# EAGLE schematic STM32-H407_Rev_B (EAGLE 4.16)
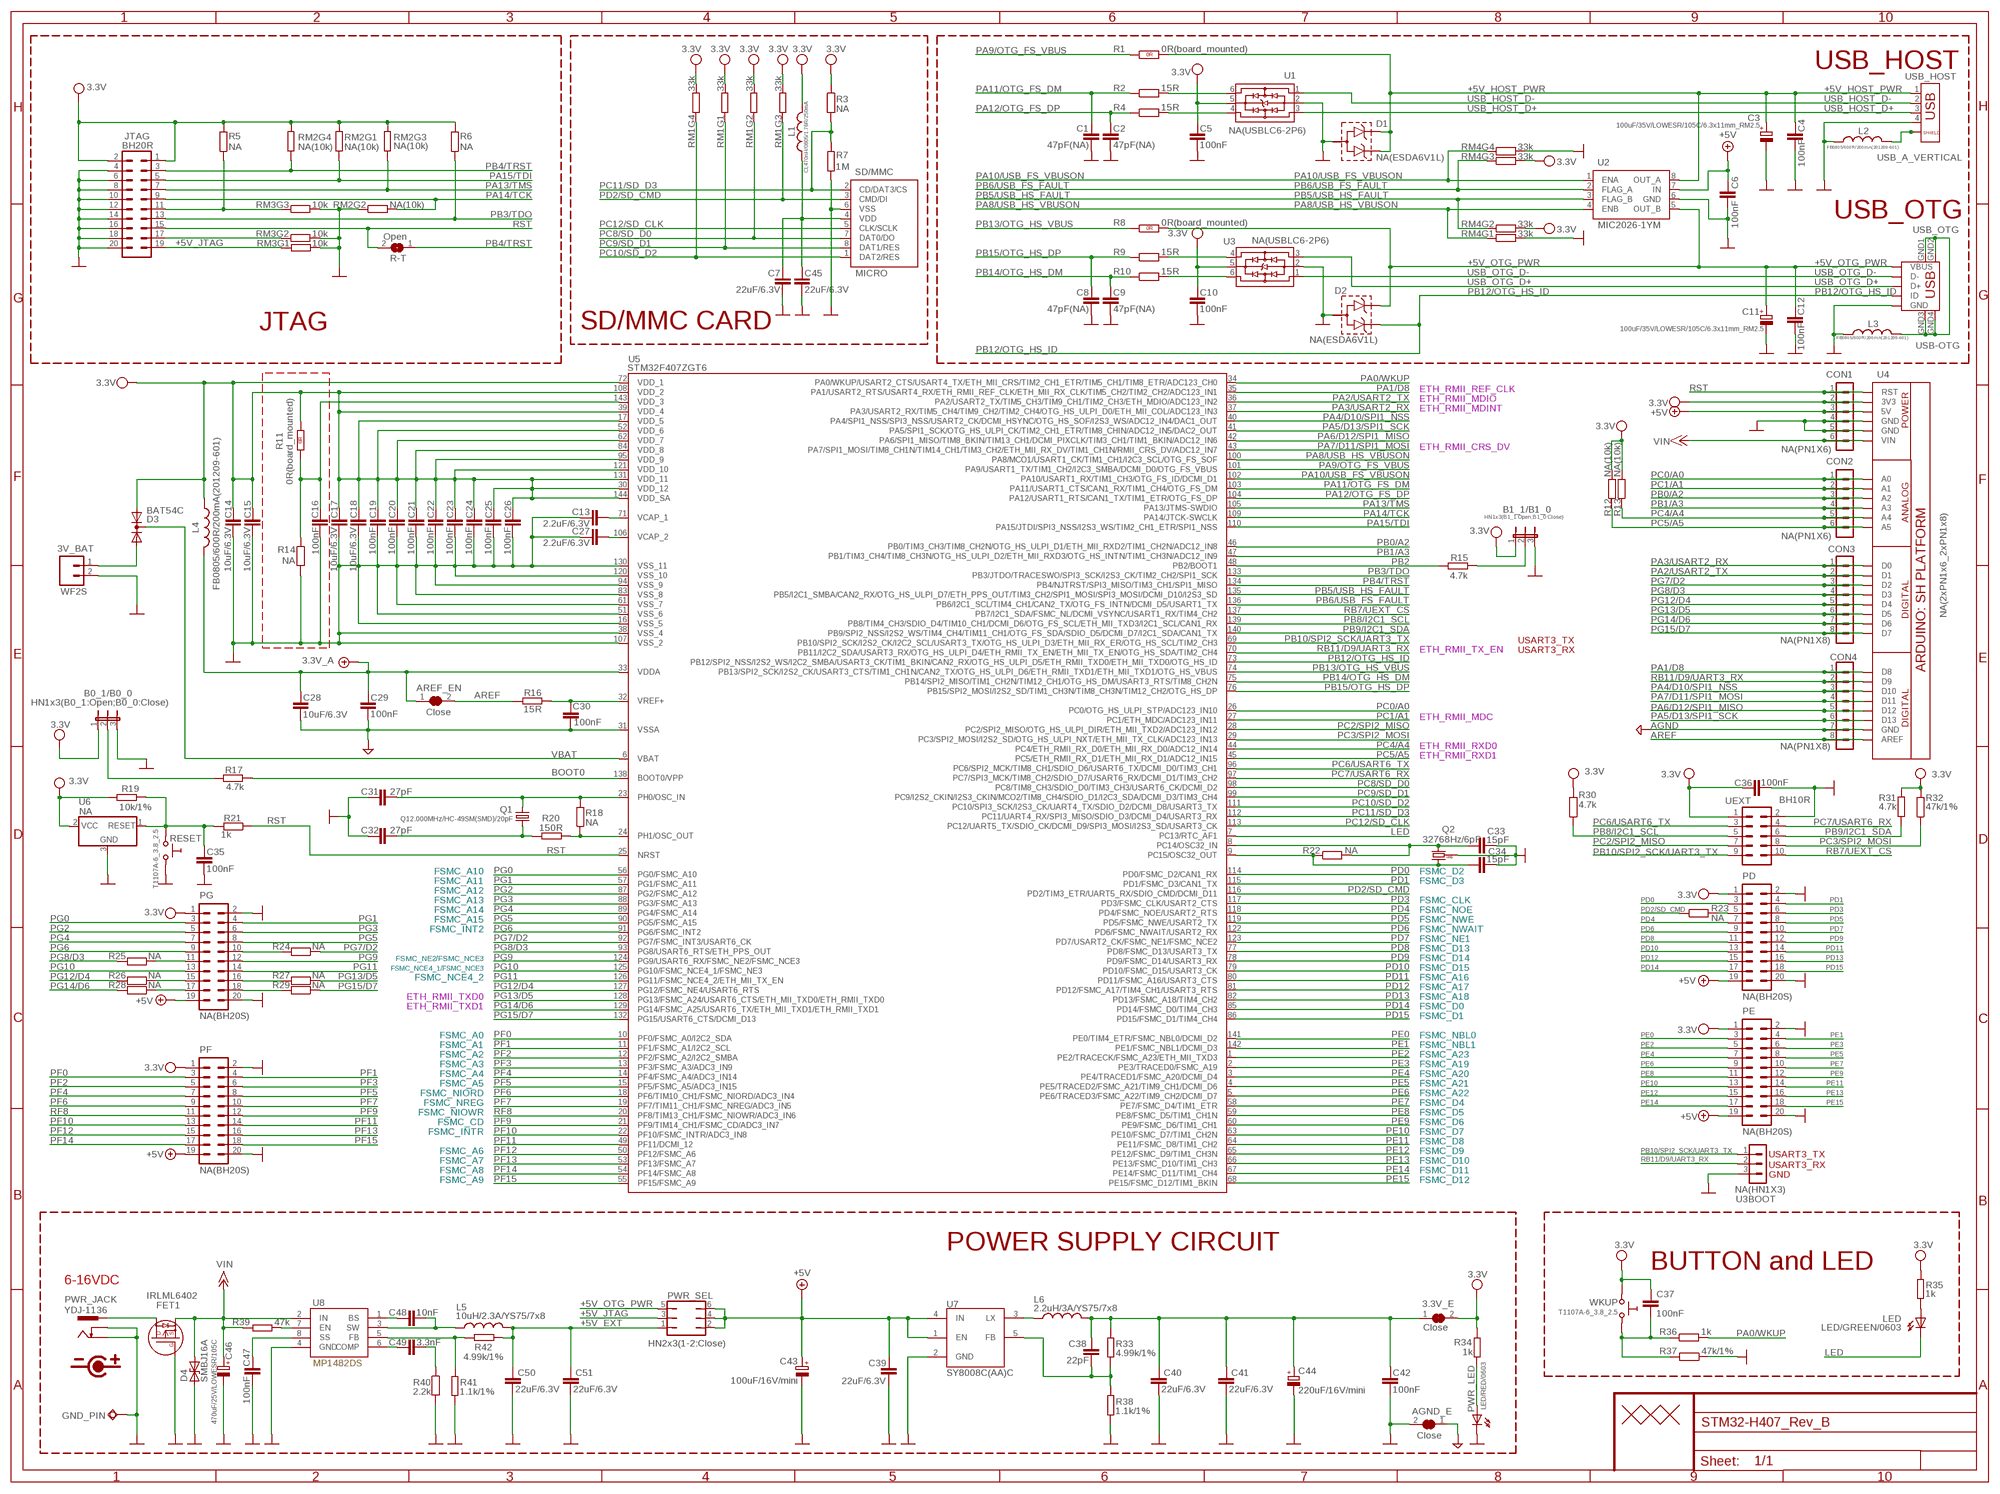
[diagram p0: schematic, sheet 1]

## Parts
3.3V_E  Close  SJSJ_1_SMALLER_CLOSE  [SJ_1_SMALLER_CLOSE]
3V_BAT  WF2S  CON2PV2-2.54MM  [CON2.54MM-2-0]
AGND_E  Close  SJSJ_1_SMALLER_CLOSE  [SJ_1_SMALLER_CLOSE]
AREF_EN  Close  SJSJ_1_SMALLER_CLOSE  [SJ_1_SMALLER_CLOSE]
B0_1/B0_0  HN1x3(B0_1:Open;B0_0:Close)  JP2E  [JP2]
B1_1/B1_0  HN1x3(B1_1:Open;B1_0:Close)  JP2E  [JP2]
C1  47pF(NA)  C-EUC0603_DWS  [C0603_DWS]
C2  47pF(NA)  C-EUC0603_DWS  [C0603_DWS]
C3  100uF/35V/LOWESR/105C/6.3x11mm_RM2.5  CPOL-EUE2.5-6.3  [E2,5-6,3]
C4  100nF  C-EUC0603_DWS  [C0603_DWS]
C5  100nF  C-EUC0603_DWS  [C0603_DWS]
C6  100nF  C-EUC0603_DWS  [C0603_DWS]
C7  22uF/6.3V  C-EUC0603_DWS  [C0603_DWS]
C8  47pF(NA)  C-EUC0603_DWS  [C0603_DWS]
C9  47pF(NA)  C-EUC0603_DWS  [C0603_DWS]
C10  100nF  C-EUC0603_DWS  [C0603_DWS]
C11  100uF/35V/LOWESR/105C/6.3x11mm_RM2.5  CPOL-EUE2.5-6.3  [E2,5-6,3]
C12  100nF  C-EUC0603_DWS  [C0603_DWS]
C13  2.2uF/6.3V  C-EUC0603_DWS  [C0603_DWS]
C14  10uF/6.3V  C-EUC0603_DWS  [C0603_DWS]
C15  10uF/6.3V  C-EUC0603_DWS  [C0603_DWS]
C16  100nF  C-EUC0603_DWS  [C0603_DWS]
C17  10uF/6.3V  C-EUC0603_DWS  [C0603_DWS]
C18  10uF/6.3V  C-EUC0603_DWS  [C0603_DWS]
C19  100nF  C-EUC0603_DWS  [C0603_DWS]
C20  100nF  C-EUC0603_DWS  [C0603_DWS]
C21  100nF  C-EUC0603_DWS  [C0603_DWS]
C22  100nF  C-EUC0603_DWS  [C0603_DWS]
C23  100nF  C-EUC0603_DWS  [C0603_DWS]
C24  100nF  C-EUC0603_DWS  [C0603_DWS]
C25  100nF  C-EUC0603_DWS  [C0603_DWS]
C26  100nF  C-EUC0603_DWS  [C0603_DWS]
C27  2.2uF/6.3V  C-EUC0603_DWS  [C0603_DWS]
C28  10uF/6.3V  C-EUC0603_DWS  [C0603_DWS]
C29  100nF  C-EUC0603_DWS  [C0603_DWS]
C30  100nF  C-EUC0603_DWS  [C0603_DWS]
C31  27pF  C-EUC0603_DWS  [C0603_DWS]
C32  27pF  C-EUC0603_DWS  [C0603_DWS]
C33  15pF  C-EUC0603_DWS  [C0603_DWS]
C34  15pF  C-EUC0603_DWS  [C0603_DWS]
C35  100nF  C-EUC0603_DWS  [C0603_DWS]
C36  100nF  C-EUC0603_DWS  [C0603_DWS]
C37  100nF  C-EUC0603_DWS  [C0603_DWS]
C38  22pF  C-EUC0603_DWS  [C0603_DWS]
C39  22uF/6.3V  C-EUC0603_DWS  [C0603_DWS]
C40  22uF/6.3V  C-EUC0603_DWS  [C0603_DWS]
C41  22uF/6.3V  C-EUC0603_DWS  [C0603_DWS]
C42  100nF  C-EUC0603_DWS  [C0603_DWS]
C43  100uF/16V/mini  CPOL-EUE2.5-6  [E2,5-6]
C44  220uF/16V/mini  CPOL-EUE3.5-8  [E3,5-8]
C45  22uF/6.3V  C-EUC0603_DWS  [C0603_DWS]
C46  470uF/25V/LOWESR/105C  CPOL-EUE5-10.5  [E5-10,5]
C47  100nF  C-EUC0603_DWS  [C0603_DWS]
C48  10nF  C-EUC0603_DWS  [C0603_DWS]
C49  3.3nF  C-EUC0603_DWS  [C0603_DWS]
C50  22uF/6.3V  C-EUC0603_DWS  [C0603_DWS]
C51  22uF/6.3V  C-EUC0603_DWS  [C0603_DWS]
CON1  NA(PN1X6)  CON6PN1X6  [PN1X6]
CON2  NA(PN1X6)  CON6PN1X6  [PN1X6]
CON3  NA(PN1X8)  CON8PN1X8  [PN1X8]
CON4  NA(PN1X8)  CON8PN1X8  [PN1X8]
D1  NA(ESDA6V1L)  MMBZ5V6ALT1  [SOT-23]
D2  NA(ESDA6V1L)  MMBZ5V6ALT1  [SOT-23]
D3  BAT54C  DIODE_AC-CA_  [SOT23C]
D4  SMBJ16A  SMBJ15A  [DO214AA]
FET1  IRLML6402  P-MOS+DIODIRLML6402  [SOT23]
GND_PIN  TESTPAD3  [TEST_PAD40/70/SQUARE]
JTAG  BH20R  ML20R  [BH20R]
L1  CL470nH/0805/1.76R/250mA  L-USL0805_5MIL_DWS  [L0805_5MIL_DWS]
L2  FB0805/600R/200mA(201209-601)  L-USL0805_5MIL_DWS  [L0805_5MIL_DWS]
L3  FB0805/600R/200mA(201209-601)  L-USL0805_5MIL_DWS  [L0805_5MIL_DWS]
L4  FB0805/600R/200mA(201209-601)  L-USL0805_5MIL_DWS  [L0805_5MIL_DWS]
L5  10uH/2.3A/YS75/7x8  L-USL7078  [L7078]
L6  2.2uH/3A/YS75/7x8  L-USL7078  [L7078]
LED  LED/GREEN/0603  LED0603DWS  [LED-0603]
PD  NA(BH20S)  ML20  [ML20-MALE]
PE  NA(BH20S)  ML20  [ML20-MALE]
PF  NA(BH20S)  ML20  [ML20-MALE]
PG  NA(BH20S)  ML20  [ML20-MALE]
PWR_JACK  YDJ-1136  PWR-JAKPWR_JACK_UNI_MILLING  [PWR_JACK_UNI_MILLING]
PWR_LED  LED/RED/0603  LED0603DWS  [LED-0603]
PWR_SEL  HN2x3(1-2:Close)  JP3QNEW  [JP3Q_NEW]
Q1  Q12.000MHz/HC-49SM(SMD)/20pF  HC49/S1  [HC49/SMD2_THIN]
Q2  32768Hz/6pF  Q_GND1  [TC26H_3_REPAIR_SMD]
R1  0R(board_mounted)  R_0R0R(NA)  [0603_0R]
R2  15R  R-EU_R0603_5MIL_DWS  [R0603_5MIL_DWS]
R3  NA  R-EU_R0603_5MIL_DWS_NA  [R0603_5MIL_DWS_NA]
R4  15R  R-EU_R0603_5MIL_DWS  [R0603_5MIL_DWS]
R5  NA  R-EU_R0603_5MIL_DWS_NA  [R0603_5MIL_DWS_NA]
R6  NA  R-EU_R0603_5MIL_DWS_NA  [R0603_5MIL_DWS_NA]
R7  1M  R-EU_R0603_5MIL_DWS  [R0603_5MIL_DWS]
R8  0R(board_mounted)  R_0R0R(NA)  [0603_0R]
R9  15R  R-EU_R0603_5MIL_DWS  [R0603_5MIL_DWS]
R10  15R  R-EU_R0603_5MIL_DWS  [R0603_5MIL_DWS]
R11  0R(board_mounted)  R_0R0R(NA)  [0603_0R]
R12  NA(10k)  R-EU_R0603_5MIL_DWS_NA  [R0603_5MIL_DWS_NA]
R13  NA(10k)  R-EU_R0603_5MIL_DWS_NA  [R0603_5MIL_DWS_NA]
R14  NA  R-EU_R0603_5MIL_DWS_NA  [R0603_5MIL_DWS_NA]
R15  4.7k  R-EU_R0603_5MIL_DWS  [R0603_5MIL_DWS]
R16  15R  R-EU_R0603_5MIL_DWS  [R0603_5MIL_DWS]
R17  4.7k  R-EU_R0603_5MIL_DWS  [R0603_5MIL_DWS]
R18  NA  R-EU_R0603_5MIL_DWS_NA  [R0603_5MIL_DWS_NA]
R19  10k/1%  R-EU_R0603_5MIL_DWS  [R0603_5MIL_DWS]
R20  150R  R-EU_R0603_5MIL_DWS  [R0603_5MIL_DWS]
R21  1k  R-EU_R0603_5MIL_DWS  [R0603_5MIL_DWS]
R22  NA  R-EU_R0603_5MIL_DWS_NA  [R0603_5MIL_DWS_NA]
R23  NA  R-EU_R0603_5MIL_DWS_NA  [R0603_5MIL_DWS_NA]
R24  NA  R-EU_R0603_5MIL_DWS  [R0603_5MIL_DWS]
R25  NA  R-EU_R0603_5MIL_DWS  [R0603_5MIL_DWS]
R26  NA  R-EU_R0603_5MIL_DWS  [R0603_5MIL_DWS]
R27  NA  R-EU_R0603_5MIL_DWS  [R0603_5MIL_DWS]
R28  NA  R-EU_R0603_5MIL_DWS  [R0603_5MIL_DWS]
R29  NA  R-EU_R0603_5MIL_DWS  [R0603_5MIL_DWS]
R30  4.7k  R-EU_R0603_5MIL_DWS  [R0603_5MIL_DWS]
R31  4.7k  R-EU_R0603_5MIL_DWS  [R0603_5MIL_DWS]
R32  47k/1%  R-EU_R0603_5MIL_DWS  [R0603_5MIL_DWS]
R33  4.99k/1%  R-EU_R0603_5MIL_DWS  [R0603_5MIL_DWS]
R34  1k  R-EU_R0603_5MIL_DWS  [R0603_5MIL_DWS]
R35  1k  R-EU_R0603_5MIL_DWS  [R0603_5MIL_DWS]
R36  1k  R-EU_R0603_5MIL_DWS  [R0603_5MIL_DWS]
R37  47k/1%  R-EU_R0603_5MIL_DWS  [R0603_5MIL_DWS]
R38  1.1k/1%  R-EU_R0603_5MIL_DWS  [R0603_5MIL_DWS]
R39  47k  R-EU_R0603_5MIL_DWS  [R0603_5MIL_DWS]
R40  2.2k  R-EU_R0603_5MIL_DWS  [R0603_5MIL_DWS]
R41  1.1k/1%  R-EU_R0603_5MIL_DWS  [R0603_5MIL_DWS]
R42  4.99k/1%  R-EU_R0603_5MIL_DWS  [R0603_5MIL_DWS]
R-T  Open  SJSJ_SMALLER  [SJ_1_SMALLER]
RESET  T1107A-6_3.8_2.5  SW-TAKT6  [SW-TAKT_6X3.5_SMD]
RM1  33k  R_MATRIX_4E  [R_MATRIX_4]
RM2  NA(10k)  R_MATRIX_4E  [R_MATRIX_4]
RM3  10k  R_MATRIX_4E  [R_MATRIX_4]
RM4  33k  R_MATRIX_4E  [R_MATRIX_4]
SD/MMC  MICRO  MICRO_SD/MMC  [TFR-MEM-CON]
U1  NA(USBLC6-2P6)  USBLC6-2  [USBLC6-2P6]
U2  MIC2026-1YM  [SO-8]
U3  NA(USBLC6-2P6)  USBLC6-2  [USBLC6-2P6]
U3BOOT  NA(HN1X3)  CON3HN1X3  [HN1X3]
U4  NA(2xPN1x6_2xPN1x8)  ARDUINO_SH_PLATFORM3  [ARDUINO_SHIELD_PLATFORM_WITHOUT_DIMENSION]
U5  STM32F407ZGT6  STM32F207ZET6  [LQFP144]
U6  NA  RESETMCP130T-300-I/TT  [SOT23]
U7  SY8008C(AA)C  SY8008  [SOT23-5]
U8  MP1482DS  MP1482  [SOIC8]
U$1  FIDUCIAL1X2  [FIDUCIAL-1X2]
U$2  FIDUCIAL1X2  [FIDUCIAL-1X2]
U$9  FIDUCIAL1X2  [FIDUCIAL-1X2]
UEXT  BH10R  ML10R  [BH10R]
USB_HOST  USB_A_VERTICAL  USB_SHIELDUSB_A_VERTICAL  [USB_A_VERTICAL_PTH]
USB_OTG  USB-OTG  MINI_USB9  [USB_MINI_9PIN]
WKUP  T1107A-6_3.8_2.5  SW-TAKT6  [SW-TAKT_6X3.5_SMD]

## Nets
+5V: C6.1 C39.1 C43.+ CON1.3 PD.19 PE.19 PF.19 PG.19 PWR_SEL.2 PWR_SEL.4 PWR_SEL.6 U2.7(IN) U4.5V U7.1(EN) U7.4(IN)
+5V_EXT: C50.1 C51.1 L5.2 PWR_SEL.1 R42.2
+5V_HOST_PWR: C3.+ C4.1 D1.1 D1.2 R1.2(1.2) U2.8(OUT_A) USB_HOST.1
+5V_JTAG: JTAG.19 PWR_SEL.3 RM3.1.1
+5V_OTG_PWR: C11.+ C12.1 D2.1 PWR_SEL.5 R8.2(1.2) U2.5(OUT_B) USB_OTG.VBUS
+7V: AREF_EN.1 C28.1 C29.2 L4.2 U5.33(VDDA) ; supply symbol labelled 3.3V_A
+15V: C46.+ CON1.6 D4.C FET1.2(S) R39.1 U4.VIN U8.2(IN) ; supply symbol labelled VIN
AGND: AGND_E.1 C28.2 C29.1 C30.1 CON4.7 U4.GND@2(GND) U5.31(VSSA)
AREF: AREF_EN.2 CON4.8 R16.1 U4.AREF
BOOT0: R17.1 U5.138(BOOT0/VPP)
GND [PWR]: 3V_BAT.2 AGND_E.2 B0_1/B0_0.3 B1_1/B1_0.3 C1.2 C2.2 C3.- C4.2 C5.1 C6.2 C7.2 C8.2 C9.2 C10.1 C11.- C12.2 C13.1 C14.1 C15.1 C16.1 C17.1 C18.1 C19.1 C20.1 C21.1 C22.1 C23.1 C24.1 C25.1 C26.1 C27.1 C31.2 C32.2 C33.2 C34.2 C35.1 C36.1 C39.2 C40.2 C41.2 C42.2 C43.- C44.- C45.2 C46.- C47.2 C50.2 C51.2 CON1.4 CON1.5 D1.3 D2.3 D4.A FET1.1(G) GND_PIN.P$1(PP) JTAG.4 JTAG.6 JTAG.8 JTAG.10 JTAG.12 JTAG.14 JTAG.16 JTAG.18 JTAG.20 L2.1 L3.1 PD.2 PD.20 PE.2 PE.20 PF.2 PF.20 PG.2 PG.20 PWR_JACK.- PWR_JACK.-- PWR_LED.C Q2.GND R7.2 R14.2 R37.1 R38.2 R40.2 R41.2 RESET.P$2 RM2.2.1 RM3.1.2 RM3.2.2 RM3.3.2 RM4.1.2 RM4.4.2 SD/MMC.6(VSS) U1.2 U2.6(GND) U3.2 U3BOOT.3 U4.GND U4.GND@1(GND) U5.16(VSS_5) U5.38(VSS_4) U5.51(VSS_6) U5.61(VSS_7) U5.83(VSS_8) U5.94(VSS_9) U5.107(VSS_2) U5.120(VSS_10) U5.130(VSS_11) U6.3(GND) U7.2(GND) U8.4(GND) UEXT.2 USB_HOST.4 USB_OTG.GND
LED: LED.C U5.7(PC13/RTC_AF1)
N$1: C31.1 Q1.2 R18.2 U5.23(PH0/OSC_IN)
N$2: C32.1 Q1.1 R20.1
N$3: R18.1 R20.2 U5.24(PH1/OSC_OUT)
N$4: JTAG.17 RM3.2.1
N$5: LED.A R35.1
N$6: PD.5 R23.2
N$8: C38.2 R33.2 R38.1 U7.5(FB)
N$9: B0_1/B0_0.2 R17.2
N$10 [PWR]: 3.3V_E.1 C38.1 C40.1 C41.1 C42.1 C44.+ L6.2 R33.1
N$12: PG.11 R25.1
N$13: PG.10 R24.2
N$14: PG.16 R27.2
N$15: R2.2 U1.6
N$16: R4.2 U1.4
N$17: PG.18 R29.2
N$18: PG.17 R28.1
N$19: PG.15 R26.1
N$25: C37.1 R36.1 R37.2 WKUP.P$2
N$29: B1_1/B1_0.2 R15.2
N$31: FET1.3(D) PWR_JACK.+
N$36: C47.1 U8.8(SS)
N$37: R39.2 U8.7(EN)
N$41: R9.2 U3.4
N$43: R10.2 U3.6
N$46: C48.1 U8.1(BS)
N$50: C48.2 L5.1 U8.3(SW)
N$60: C49.1 U8.6(COMP)
N$61: C49.2 R40.1
N$62: R41.1 R42.1 U8.5(FB)
N$64: L6.1 U7.3(LX)
N$75: 3V_BAT.1 D3.2(A2)
N$78: C7.1 C45.1 L1.2 SD/MMC.4(VDD)
N$85: JTAG.11 R5.1 RM3.3.1
N$117: C13.2 U5.71(VCAP_1)
N$128: C27.2 U5.106(VCAP_2)
N$129: PWR_LED.A R34.2
N$163: C35.2 R19.1 R21.2 RESET.P$1 U6.1(RESET)
N$266: L2.2 USB_HOST.P$3 USB_HOST.P$4
N$470: C16.2 R11.1(1.1) R14.1 U5.143(VDD_3)
PA0/WKUP: R36.2 U5.34(PA0/WKUP/USART2_CTS/USART4_TX/ETH_MII_CRS/TIM2_CH1_ETR/TIM5_CH1/TIM8_ETR/ADC123_CH0)
PA1/D8: CON4.1 U4.D8 U5.35(PA1/USART2_RTS/USART4_RX/ETH_RMII_REF_CLK/ETH_MII_RX_CLK/TIM5_CH2/TIM2_CH2/ADC123_IN1)
PA2/USART2_TX [thin]: CON3.2 U4.D1 U5.36(PA2/USART2_TX/TIM5_CH3/TIM9_CH1/TIM2_CH3/ETH_MDIO/ADC123_IN2)
PA3/USART2_RX: CON3.1 U4.D0 U5.37(PA3/USART2_RX/TIM5_CH4/TIM9_CH2/TIM2_CH4/OTG_HS_ULPI_D0/ETH_MII_COL/ADC123_IN3)
PA4/D10/SPI1_NSS: CON4.3 U4.D10 U5.40(PA4/SPI1_NSS/SPI3_NSS/USART2_CK/DCMI_HSYNC/OTG_HS_SOF/I2S3_WS/ADC12_IN4/DAC1_OUT)
PA5/D13/SPI1_SCK: CON4.6 U4.D13 U5.41(PA5/SPI1_SCK/OTG_HS_ULPI_CK/TIM2_CH1_ETR/TIM8_CHIN/ADC12_IN5/DAC2_OUT)
PA6/D12/SPI1_MISO: CON4.5 U4.D12 U5.42(PA6/SPI1_MISO/TIM8_BKIN/TIM13_CH1/DCMI_PIXCLK/TIM3_CH1/TIM1_BKIN/ADC12_IN6)
PA7/D11/SPI1_MOSI: CON4.4 U4.D11 U5.43(PA7/SPI1_MOSI/TIM8_CH1N/TIM14_CH1/TIM3_CH2/ETH_MII_RX_DV/TIM1_CH1N/RMII_CRS_DV/ADC12_IN7)
PA8/USB_HS_VBUSON: RM4.1.1 U2.4(ENB) U5.100(PA8/MCO1/USART1_CK/TIM1_CH1/I2C3_SCL/OTG_FS_SOF)
PA9/OTG_FS_VBUS: R1.1(1.1) U5.101(PA9/USART1_TX/TIM1_CH2/I2C3_SMBA/DCMI_D0/OTG_FS_VBUS)
PA10/USB_FS_VBUSON: RM4.4.1 U2.1(ENA) U5.102(PA10/USART1_RX/TIM1_CH3/OTG_FS_ID/DCMI_D1)
PA11/OTG_FS_DM: C1.1 R2.1 U5.103(PA11/USART1_CTS/CAN1_RX/TIM1_CH4/OTG_FS_DM)
PA12/OTG_FS_DP: C2.1 R4.1 U5.104(PA12/USART1_RTS/CAN1_TX/TIM1_ETR/OTG_FS_DP)
PA13/TMS: JTAG.7 RM2.3.1 U5.105(PA13/JTMS-SWDIO)
PA14/TCK: JTAG.9 RM2.2.2 U5.109(PA14/JTCK-SWCLK)
PA15/TDI: JTAG.5 RM2.1.1 U5.110(PA15/JTDI/SPI3_NSS/I2S3_WS/TIM2_CH1_ETR/SPI1_NSS)
PB0/A2: CON2.3 U4.A2 U5.46(PB0/TIM3_CH3/TIM8_CH2N/OTG_HS_ULPI_D1/ETH_MII_RXD2/TIM1_CH2N/ADC12_IN8)
PB1/A3: CON2.4 U4.A3 U5.47(PB1/TIM3_CH4/TIM8_CH3N/OTG_HS_ULPI_D2/ETH_MII_RXD3/OTG_HS_INTN/TIM1_CH3N/ADC12_IN9)
PB2: R15.1 U5.48(PB2/BOOT1)
PB3/TDO: JTAG.13 R6.1 U5.133(PB3/JTDO/TRACESWO/SPI3_SCK/I2S3_CK/TIM2_CH2/SPI1_SCK)
PB4/TRST: JTAG.3 R-T.1 RM2.4.1 U5.134(PB4/NJTRST/SPI3_MISO/TIM3_CH1/SPI1_MISO)
PB5/USB_HS_FAULT: RM4.2.1 U2.3(FLAG_B) U5.135(PB5/I2C1_SMBA/CAN2_RX/OTG_HS_ULPI_D7/ETH_PPS_OUT/TIM3_CH2/SPI1_MOSI/SPI3_MOSI/DCMI_D10/I2S3_SD)
PB6/USB_FS_FAULT: RM4.3.1 U2.2(FLAG_A) U5.136(PB6/I2C1_SCL/TIM4_CH1/CAN2_TX/OTG_FS_INTN/DCMI_D5/USART1_TX)
PB8/I2C1_SCL: R30.1 U5.139(PB8/TIM4_CH3/SDIO_D4/TIM10_CH1/DCMI_D6/OTG_FS_SCL/ETH_MII_TXD3/I2C1_SCL/CAN1_RX) UEXT.5
PB9/I2C1_SDA: R31.1 U5.140(PB9/SPI2_NSS/I2S2_WS/TIM4_CH4/TIM11_CH1/OTG_FS_SDA/SDIO_D5/DCMI_D7/I2C1_SDA/CAN1_TX) UEXT.6
PB10/SPI2_SCK/UART3_TX: U3BOOT.1 U5.69(PB10/SPI2_SCK/I2S2_CK/I2C2_SCL/USART3_TX/OTG_HS_ULPI_D3/ETH_MII_RX_ER/OTG_HS_SCL/TIM2_CH3) UEXT.9
PB12/OTG_HS_ID: D2.2 U5.73(PB12/SPI2_NSS/I2S2_WS/I2C2_SMBA/USART3_CK/TIM1_BKIN/CAN2_RX/OTG_HS_ULPI_D5/ETH_RMII_TXD0/ETH_MII_TXD0/OTG_HS_ID) USB_OTG.ID
PB13/OTG_HS_VBUS: R8.1(1.1) U5.74(PB13/SPI2_SCK/I2S2_CK/USART3_CTS/TIM1_CH1N/CAN2_TX/OTG_HS_ULPI_D6/ETH_RMII_TXD1/ETH_MII_TXD1/OTG_HS_VBUS)
PB14/OTG_HS_DM: C9.1 R10.1 U5.75(PB14/SPI2_MISO/TIM1_CH2N/TIM12_CH1/OTG_HS_DM/USART3_RTS/TIM8_CH2N)
PB15/OTG_HS_DP: C8.1 R9.1 U5.76(PB15/SPI2_MOSI/I2S2_SD/TIM1_CH3N/TIM8_CH3N/TIM12_CH2/OTG_HS_DP)
PC0/A0: CON2.1 U4.A0 U5.26(PC0/OTG_HS_ULPI_STP/ADC123_IN10)
PC1/A1: CON2.2 U4.A1 U5.27(PC1/ETH_MDC/ADC123_IN11)
PC2/SPI2_MISO: U5.28(PC2/SPI2_MISO/OTG_HS_ULPI_DIR/ETH_MII_TXD2/ADC123_IN12) UEXT.7
PC3/SPI2_MOSI: R32.1 U5.29(PC3/SPI2_MOSI/I2S2_SD/OTG_HS_ULPI_NXT/ETH_MII_TX_CLK/ADC123_IN13) UEXT.8
PC4/A4: CON2.5 R13.1 U4.A4 U5.44(PC4/ETH_RMII_RX_D0/ETH_MII_RX_D0/ADC12_IN14)
PC5/A5: CON2.6 R12.1 U4.A5 U5.45(PC5/ETH_RMII_RX_D1/ETH_MII_RX_D1/ADC12_IN15)
PC6/USART6_TX: U5.96(PC6/SPI2_MCK/TIM8_CH1/SDIO_D6/USART6_TX/DCMI_D0/TIM3_CH1) UEXT.3
PC7/USART6_RX: U5.97(PC7/SPI3_MCK/TIM8_CH2/SDIO_D7/USART6_RX/DCMI_D1/TIM3_CH2) UEXT.4
PC8/SD_D0: RM1.2.1 SD/MMC.7(DAT0/DO) U5.98(PC8/TIM8_CH3/SDIO_D0/TIM3_CH3/USART6_CK/DCMI_D2)
PC9/SD_D1: RM1.1.1 SD/MMC.8(DAT1/RES) U5.99(PC9/I2S2_CKIN/I2S3_CKIN/MCO2/TIM8_CH4/SDIO_D1/I2C3_SDA/DCMI_D3/TIM3_CH4)
PC10/SD_D2: RM1.4.1 SD/MMC.1(DAT2/RES) U5.111(PC10/SPI3_SCK/I2S3_CK/UART4_TX/SDIO_D2/DCMI_D8/USART3_TX)
PC11/SD_D3: R3.2 R7.1 SD/MMC.2(CD/DAT3/CS) U5.112(PC11/UART4_RX/SPI3_MISO/SDIO_D3/DCMI_D4/USART3_RX)
PC12/SD_CLK: SD/MMC.5(CLK/SCLK) U5.113(PC12/UART5_TX/SDIO_CK/DCMI_D9/SPI3_MOSI/I2S3_SD/USART3_CK)
PC14: C33.1 Q2.2 R22.2 U5.8(PC14/OSC32_IN)
PC15: C34.1 Q2.1 R22.1 U5.9(PC15/OSC32_OUT)
PD0: PD.3 U5.114(PD0/FSMC_D2/CAN1_RX)
PD1 [thin]: PD.4 U5.115(PD1/FSMC_D3/CAN1_TX)
PD2/SD_CMD: R23.1 RM1.3.1 SD/MMC.3(CMD/DI) U5.116(PD2/TIM3_ETR/UART5_RX/SDIO_CMD/DCMI_D11)
PD3: PD.6 U5.117(PD3/FSMC_CLK/USART2_CTS)
PD4: PD.7 U5.118(PD4/FSMC_NOE/USART2_RTS)
PD5: PD.8 U5.119(PD5/FSMC_NWE/USART2_TX)
PD6: PD.9 U5.122(PD6/FSMC_NWAIT/USART2_RX)
PD7: PD.10 U5.123(PD7/USART2_CK/FSMC_NE1/FSMC_NCE2)
PD8 [thin]: PD.11 U5.77(PD8/FSMC_D13/USART3_TX)
PD9: PD.12 U5.78(PD9/FSMC_D14/USART3_RX)
PD10: PD.13 U5.79(PD10/FSMC_D15/USART3_CK)
PD11 [thin]: PD.14 U5.80(PD11/FSMC_A16/USART3_CTS)
PD12 [thin]: PD.15 U5.81(PD12/FSMC_A17/TIM4_CH1/USART3_RTS)
PD13: PD.16 U5.82(PD13/FSMC_A18/TIM4_CH2)
PD14: PD.17 U5.85(PD14/FSMC_D0/TIM4_CH3)
PD15 [thin]: PD.18 U5.86(PD15/FSMC_D1/TIM4_CH4)
PE0: PE.3 U5.141(PE0/TIM4_ETR/FSMC_NBL0/DCMI_D2)
PE1 [thin]: PE.4 U5.142(PE1/FSMC_NBL1/DCMI_D3)
PE2: PE.5 U5.1(PE2/TRACECK/FSMC_A23/ETH_MII_TXD3)
PE3: PE.6 U5.2(PE3/TRACED0/FSMC_A19)
PE4: PE.7 U5.3(PE4/TRACED1/FSMC_A20/DCMI_D4)
PE5: PE.8 U5.4(PE5/TRACED2/FSMC_A21/TIM9_CH1/DCMI_D6)
PE6: PE.9 U5.5(PE6/TRACED3/FSMC_A22/TIM9_CH2/DCMI_D7)
PE7 [thin]: PE.10 U5.58(PE7/FSMC_D4/TIM1_ETR)
PE8 [thin]: PE.11 U5.59(PE8/FSMC_D5/TIM1_CH1N)
PE9: PE.12 U5.60(PE9/FSMC_D6/TIM1_CH1)
PE10: PE.13 U5.63(PE10/FSMC_D7/TIM1_CH2N)
PE11: PE.14 U5.64(PE11/FSMC_D8/TIM1_CH2)
PE12: PE.15 U5.65(PE12/FSMC_D9/TIM1_CH3N)
PE13 [thin]: PE.16 U5.66(PE13/FSMC_D10/TIM1_CH3)
PE14 [thin]: PE.17 U5.67(PE14/FSMC_D11/TIM1_CH4)
PE15 [thin]: PE.18 U5.68(PE15/FSMC_D12/TIM1_BKIN)
PF0: PF.3 U5.10(PF0/FSMC_A0/I2C2_SDA)
PF1: PF.4 U5.11(PF1/FSMC_A1/I2C2_SCL)
PF2: PF.5 U5.12(PF2/FSMC_A2/I2C2_SMBA)
PF3: PF.6 U5.13(PF3/FSMC_A3/ADC3_IN9)
PF4: PF.7 U5.14(PF4/FSMC_A4/ADC3_IN14)
PF5 [thin]: PF.8 U5.15(PF5/FSMC_A5/ADC3_IN15)
PF6: PF.9 U5.18(PF6/TIM10_CH1/FSMC_NIORD/ADC3_IN4)
PF7: PF.10 U5.19(PF7/TIM11_CH1/FSMC_NREG/ADC3_IN5)
PF9: PF.12 U5.21(PF9/TIM14_CH1/FSMC_CD/ADC3_IN7)
PF10: PF.13 U5.22(PF10/FSMC_INTR/ADC3_IN8)
PF11: PF.14 U5.49(PF11/DCMI_12)
PF12 [thin]: PF.15 U5.50(PF12/FSMC_A6)
PF13 [thin]: PF.16 U5.53(PF13/FSMC_A7)
PF14 [thin]: PF.17 U5.54(PF14/FSMC_A8)
PF15: PF.18 U5.55(PF15/FSMC_A9)
PG0 [thin]: PG.3 U5.56(PG0/FSMC_A10)
PG1 [thin]: PG.4 U5.57(PG1/FSMC_A11)
PG2: PG.5 U5.87(PG2/FSMC_A12)
PG3: PG.6 U5.88(PG3/FSMC_A13)
PG4 [thin]: PG.7 U5.89(PG4/FSMC_A14)
PG5 [thin]: PG.8 U5.90(PG5/FSMC_A15)
PG6: PG.9 U5.91(PG6/FSMC_INT2)
PG7/D2: CON3.3 R24.1 U4.D2 U5.92(PG7/FSMC_INT3/USART6_CK)
PG8/D3: CON3.4 R25.2 U4.D3 U5.93(PG8/USART6_RTS/ETH_PPS_OUT)
PG9: PG.12 U5.124(PG9/USART6_RX/FSMC_NE2/FSMC_NCE3)
PG10: PG.13 U5.125(PG10/FSMC_NCE4_1/FSMC_NE3)
PG11: PG.14 U5.126(PG11/FSMC_NCE4_2/ETH_MII_TX_EN)
PG12/D4: CON3.5 R26.2 U4.D4 U5.127(PG12/FSMC_NE4/USART6_RTS)
PG13/D5: CON3.6 R27.1 U4.D5 U5.128(PG13/FSMC_A24/USART6_CTS/ETH_MII_TXD0/ETH_RMII_TXD0)
PG14/D6: CON3.7 R28.2 U4.D6 U5.129(PG14/FSMC_A25/USART6_TX/ETH_MII_TXD1/ETH_RMII_TXD1)
PG15/D7: CON3.8 R29.1 U4.D7 U5.132(PG15/USART6_CTS/DCMI_D13)
RB7/UEXT_CS: U5.137(PB7/I2C1_SDA/FSMC_NL/DCMI_VSYNC/USART1_RX/TIM4_CH2) UEXT.10
RB11/D9/UART3_RX: CON4.2 U3BOOT.2 U4.D9 U5.70(PB11/I2C2_SDA/USART3_RX/OTG_HS_ULPI_D4/ETH_RMII_TX_EN/ETH_MII_TX_EN/OTG_HS_SDA/TIM2_CH4)
RF8: PF.11 U5.20(PF8/TIM13_CH1/FSMC_NIOWR/ADC3_IN6)
RST: CON1.1 JTAG.15 R21.1 R-T.2 U4.RST U5.25(NRST)
USB_HOST_D+: U1.3 USB_HOST.3
USB_HOST_D-: U1.1 USB_HOST.2
USB_OTG_D+: U3.3 USB_OTG.D+
USB_OTG_D-: U3.1 USB_OTG.D-
USB_SHIELD: L3.2 USB_OTG.GND1 USB_OTG.GND2 USB_OTG.GND3 USB_OTG.GND4
VBAT: D3.3(K) U5.6(VBAT)
VCC [PWR]: 3.3V_E.2 B0_1/B0_0.1 B1_1/B1_0.1 C5.2 C10.2 C14.2 C15.2 C17.2 C18.2 C19.2 C20.2 C21.2 C22.2 C23.2 C24.2 C25.2 C26.2 C36.2 C37.2 CON1.2 D3.1(A1) JTAG.1 JTAG.2 L1.1 L4.1 PD.1 PE.1 PF.1 PG.1 R3.1 R5.2 R6.2 R11.2(1.2) R12.2 R13.2 R19.2 R30.2 R31.2 R32.2 R34.1 R35.2 RM1.1.2 RM1.2.2 RM1.3.2 RM1.4.2 RM2.1.2 RM2.3.2 RM2.4.2 RM4.2.2 RM4.3.2 U1.5 U3.5 U4.3V3 U5.17(VDD_5) U5.30(VDD_12) U5.39(VDD_4) U5.52(VDD_6) U5.62(VDD_7) U5.72(VDD_1) U5.84(VDD_8) U5.95(VDD_9) U5.108(VDD_2) U5.121(VDD_10) U5.131(VDD_11) U5.144(VDD_SA) U6.2(VCC) UEXT.1 WKUP.P$1 ; supply symbol labelled 3.3V
VREF+: C30.2 R16.2 U5.32(VREF+)
Unconnected: RM3.4.1 RM3.4.2

## Notes on the sheet
- USB_HOST
- USB_OTG
- JTAG | SD/MMC CARD
- ETH_RMII_REF_CLK
- ETH_RMII_MDIO
- ETH_RMII_MDINT
- ETH_RMII_CRS_DV
- USART3_TX
- ETH_RMII_TX_EN | USART3_RX
- ETH_RMII_MDC
- ETH_RMII_RXD0
- ETH_RMII_RXD1
- FSMC_A10 | FSMC_D2
- FSMC_A11 | FSMC_D3
- FSMC_A12
- FSMC_A13 | FSMC_CLK
- FSMC_A14 | FSMC_NOE
- FSMC_A15 | FSMC_NWE
- FSMC_INT2 | FSMC_NWAIT
- FSMC_NE1
- FSMC_D13
- FSMC_NE2/FSMC_NCE3 | FSMC_D14
- FSMC_NCE4_1/FSMC_NCE3 | FSMC_D15
- FSMC_NCE4_2 | FSMC_A16
- FSMC_A17
- ETH_RMII_TXD0 | FSMC_A18
- ETH_RMII_TXD1 | FSMC_D0
- FSMC_D1
- FSMC_A0 | FSMC_NBL0
- FSMC_A1 | FSMC_NBL1
- FSMC_A2 | FSMC_A23
- FSMC_A3 | FSMC_A19
- FSMC_A4 | FSMC_A20
- FSMC_A5 | FSMC_A21
- FSMC_NIORD | FSMC_A22
- FSMC_NREG | FSMC_D4
- FSMC_NIOWR | FSMC_D5
- FSMC_CD | FSMC_D6
- FSMC_INTR | FSMC_D7
- FSMC_D8
- USART3_TX
- FSMC_A6 | FSMC_D9
- FSMC_A7 | FSMC_D10 | USART3_RX
- FSMC_A8 | FSMC_D11 | GND
- FSMC_A9 | FSMC_D12
- POWER SUPPLY CIRCUIT
- BUTTON and LED
- 6-16VDC

## Library data of the parts
3.3V_E AGND_E AREF_EN R-T = jumper:SJ: SMD solder JUMPER
3V_BAT = DOUBLE-SIDE:CON2: CONNECTORS - 2 PINS
B0_1/B0_0 B1_1/B1_0 = jumper:JP2E: JUMPER
C1 C2 C4-C10 C12-C42 C45 C47-C51 = rcl:C-EU: CAPACITOR, European symbol
C3 C11 C43 C44 C46 = rcl:CPOL-EU: POLARIZED CAPACITOR, European symbol
CON1 CON2 = Penko:CON6: CONNECTORS - 6 PINS
CON3 CON4 = Penko:CON8
D1 D2 = OLIMEX_DISCRET:MMBZ5V6ALT1
D3 = semicon-smd-ipc:DIODE_AC-CA_: DUAL DIODE
D4 = OLIMEX_DISCRET:SMBJ15A
FET1 = Penko:P-MOS+DIOD
GND_PIN = gogo:TESTPAD: drill 40mils, diameter 70mils
JTAG PD PE PF PG = con-harting-ml:ML20: HARTING
L1-L6 = rcl:L-US: INDUCTOR, American symbol
LED PWR_LED = DOUBLE-SIDE:LED
PWR_JACK = gogo:PWR-JAK
PWR_SEL = jumper:JP3Q: JUMPER
Q1 = crystal:HC49/S: CRYSTAL
Q2 = crystal:Q_GND
R1 R8 R11 = OLIMEX_DISCRET:R_0R
R2-R7 R9 R10 R12-R42 = rcl:R-EU_: RESISTOR, European symbol
RESET WKUP = gogo:SW-TAKT
RM1-RM4 = OLIMEX_DISCRET:R_MATRIX_4E
SD/MMC = OLIMEX_CONNECTORS:MICRO_SD/MMC
U1 U3 = OLIMEX_IC:USBLC6-2
U2 = OLIMEX_IC:MIC2026: LM3526 Dual Port USB Power Switch and Over-Current Protection Features: -> Compatible with USB1.1 and USB2.0; -> 1 ms fault flag delay filters Hot-Plug events; -> Smooth turn-on eliminates in-rush induced voltage drop; -> UL recognized component: REF#205202; -> 1A nominal shortcircuit output current protects PC power supplies; -> Thermal shutdown protects device in direct short condition; -> 500mA minimum continuous load current; -> Small SO-8 package minimizes board space; -> 2.7V to 5.5V input voltage range; -> 140mOhm Max.switch resistance; -> 1 µA Max. standby current; -> 200µA Max. operating current; -> Under-voltage lockout(UVLO);
U3BOOT = Penko:CON3
U4 = OLIMEX_CASES:ARDUINO_SH_PLATFORM
U5 = OLIMEX_IC:STM32F207ZE: STM32F207ZE ARM-based 32-bit MCU, 150DMIPs, up to 1 MB Flash/128+4KB RAM,USB OTG HS/FS, Ethernet, 17 TIMs, 3 ADCs, 15 comm. interfaces & camera
U6 = gogo:RESET: Microcontroller Supervisory Circuit with Open Drain Output
U7 = OLIMEX_IC:SY8008
U8 = OLIMEX_IC:MP1482
U$1 U$2 U$9 = SparkFunEagle-6-6-07:FIDUCIAL: Fiducial Alignment Points Various fiducial points for machine vision alignment.
UEXT = con-harting-ml:ML10: HARTING
USB_HOST = OLIMEX_CONNECTORS:USB_SHIELD
USB_OTG = OLIMEX_CONNECTORS:MINI_USB9

## Net classes
1 PWR: width 0.203 mm, drill 0.076 mm, clearance 0.4 mm
2 thin: width 0.025 mm, drill 0.025 mm
3 gsm_pwr: width 0.914 mm, clearance 0.787 mm